# EAGLE schematic SOTB_LWC (EAGLE 9.6.2)
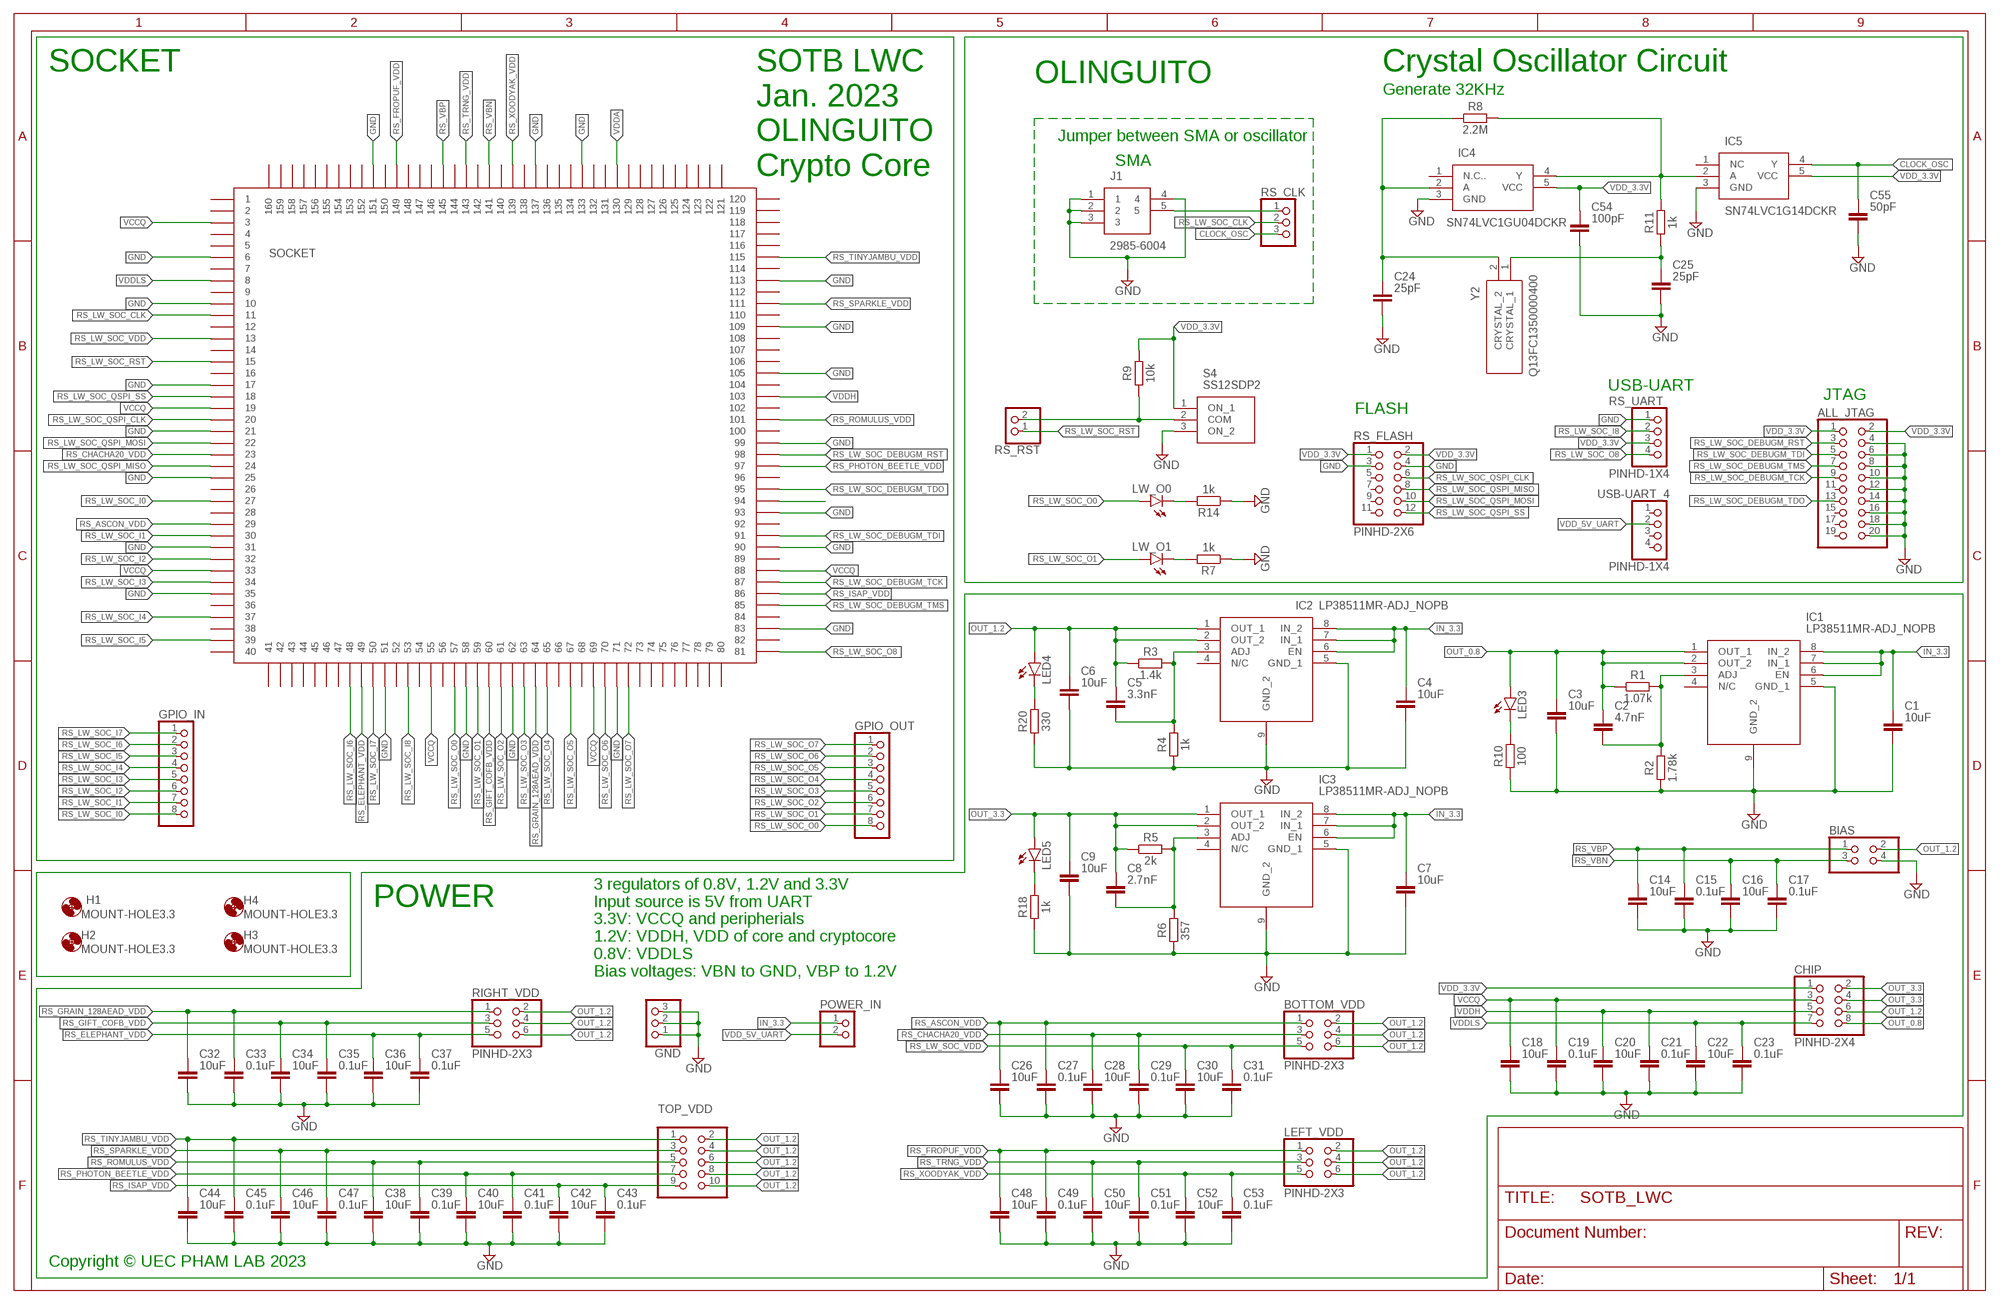
[diagram p0: schematic, sheet 1]

## Parts
ALL_JTAG  PINHD-2X10  [2X10]
BIAS  PINHD-2X2  [2X02]
BOTTOM_VDD  PINHD-2X3  [2X03]
C1  10uF  C_CHIP-1206(3216-METRIC)  [CAPC3216X135]
C2  4.7nF  C_CHIP-1206(3216-METRIC)  [CAPC3216X135]
C3  10uF  C_CHIP-1206(3216-METRIC)  [CAPC3216X135]
C4  10uF  C_CHIP-1206(3216-METRIC)  [CAPC3216X135]
C5  3.3nF  C_CHIP-1206(3216-METRIC)  [CAPC3216X135]
C6  10uF  C_CHIP-1206(3216-METRIC)  [CAPC3216X135]
C7  10uF  C_CHIP-1206(3216-METRIC)  [CAPC3216X135]
C8  2.7nF  C_CHIP-1206(3216-METRIC)  [CAPC3216X135]
C9  10uF  C_CHIP-1206(3216-METRIC)  [CAPC3216X135]
C14  10uF  C_CHIP-1206(3216-METRIC)  [CAPC3216X135]
C15  0.1uF  C_CHIP-1206(3216-METRIC)  [CAPC3216X135]
C16  10uF  C_CHIP-1206(3216-METRIC)  [CAPC3216X135]
C17  0.1uF  C_CHIP-1206(3216-METRIC)  [CAPC3216X135]
C18  10uF  C_CHIP-1206(3216-METRIC)  [CAPC3216X135]
C19  0.1uF  C_CHIP-1206(3216-METRIC)  [CAPC3216X135]
C20  10uF  C_CHIP-1206(3216-METRIC)  [CAPC3216X135]
C21  0.1uF  C_CHIP-1206(3216-METRIC)  [CAPC3216X135]
C22  10uF  C_CHIP-1206(3216-METRIC)  [CAPC3216X135]
C23  0.1uF  C_CHIP-1206(3216-METRIC)  [CAPC3216X135]
C24  25pF  C_CHIP-0805(2012-METRIC)  [CAPC2012X110]
C25  25pF  C_CHIP-0805(2012-METRIC)  [CAPC2012X110]
C26  10uF  C_CHIP-1206(3216-METRIC)  [CAPC3216X135]
C27  0.1uF  C_CHIP-1206(3216-METRIC)  [CAPC3216X135]
C28  10uF  C_CHIP-1206(3216-METRIC)  [CAPC3216X135]
C29  0.1uF  C_CHIP-1206(3216-METRIC)  [CAPC3216X135]
C30  10uF  C_CHIP-1206(3216-METRIC)  [CAPC3216X135]
C31  0.1uF  C_CHIP-1206(3216-METRIC)  [CAPC3216X135]
C32  10uF  C_CHIP-1206(3216-METRIC)  [CAPC3216X135]
C33  0.1uF  C_CHIP-1206(3216-METRIC)  [CAPC3216X135]
C34  10uF  C_CHIP-1206(3216-METRIC)  [CAPC3216X135]
C35  0.1uF  C_CHIP-1206(3216-METRIC)  [CAPC3216X135]
C36  10uF  C_CHIP-1206(3216-METRIC)  [CAPC3216X135]
C37  0.1uF  C_CHIP-1206(3216-METRIC)  [CAPC3216X135]
C38  10uF  C_CHIP-1206(3216-METRIC)  [CAPC3216X135]
C39  0.1uF  C_CHIP-1206(3216-METRIC)  [CAPC3216X135]
C40  10uF  C_CHIP-1206(3216-METRIC)  [CAPC3216X135]
C41  0.1uF  C_CHIP-1206(3216-METRIC)  [CAPC3216X135]
C42  10uF  C_CHIP-1206(3216-METRIC)  [CAPC3216X135]
C43  0.1uF  C_CHIP-1206(3216-METRIC)  [CAPC3216X135]
C44  10uF  C_CHIP-1206(3216-METRIC)  [CAPC3216X135]
C45  0.1uF  C_CHIP-1206(3216-METRIC)  [CAPC3216X135]
C46  10uF  C_CHIP-1206(3216-METRIC)  [CAPC3216X135]
C47  0.1uF  C_CHIP-1206(3216-METRIC)  [CAPC3216X135]
C48  10uF  C_CHIP-1206(3216-METRIC)  [CAPC3216X135]
C49  0.1uF  C_CHIP-1206(3216-METRIC)  [CAPC3216X135]
C50  10uF  C_CHIP-1206(3216-METRIC)  [CAPC3216X135]
C51  0.1uF  C_CHIP-1206(3216-METRIC)  [CAPC3216X135]
C52  10uF  C_CHIP-1206(3216-METRIC)  [CAPC3216X135]
C53  0.1uF  C_CHIP-1206(3216-METRIC)  [CAPC3216X135]
C54  100pF  C_CHIP-0805(2012-METRIC)  [CAPC2012X110]
C55  50pF  C_CHIP-0805(2012-METRIC)  [CAPC2012X110]
CHIP  PINHD-2X4  [2X04]
GND  PINHD-1X3  [1X03]
GPIO_IN  PINHD-1X8  [1X08]
GPIO_OUT  PINHD-1X8  [1X08]
H1  MOUNT-HOLE3.3  [3,3]
H2  MOUNT-HOLE3.3  [3,3]
H3  MOUNT-HOLE3.3  [3,3]
H4  MOUNT-HOLE3.3  [3,3]
IC1  LP38511MR-ADJ_NOPB  [SOIC127P600X170-9N]
IC2  LP38511MR-ADJ_NOPB  [SOIC127P600X170-9N]
IC3  LP38511MR-ADJ_NOPB  [SOIC127P600X170-9N]
IC4  SN74LVC1GU04DCKR  [SOT65P210X110-5N]
IC5  SN74LVC1G14DCKR  [SOT65P210X110-5N]
J1  2985-6004  [29856004]
LED3  LEDCHIPLED_0805  [CHIPLED_0805]
LED4  LEDCHIPLED_0805  [CHIPLED_0805]
LED5  LEDCHIPLED_0805  [CHIPLED_0805]
LEFT_VDD  PINHD-2X3  [2X03]
LW_O0  LEDCHIPLED_0805  [CHIPLED_0805]
LW_O1  LEDCHIPLED_0805  [CHIPLED_0805]
POWER_IN  PINHD-1X2  [1X02]
R1  1.07k  R_CHIP-1206(3216-METRIC)  [RESC3216X70]
R2  1.78k  R_CHIP-1206(3216-METRIC)  [RESC3216X70]
R3  1.4k  R_CHIP-1206(3216-METRIC)  [RESC3216X70]
R4  1k  R_CHIP-1206(3216-METRIC)  [RESC3216X70]
R5  2k  R_CHIP-1206(3216-METRIC)  [RESC3216X70]
R6  357  R_CHIP-1206(3216-METRIC)  [RESC3216X70]
R7  1k  R_CHIP-1206(3216-METRIC)  [RESC3216X70]
R8  2.2M  R_CHIP-1206(3216-METRIC)  [RESC3216X70]
R9  10k  R_CHIP-1206(3216-METRIC)  [RESC3216X70]
R10  100  R_CHIP-1206(3216-METRIC)  [RESC3216X70]
R11  1k  R_CHIP-1206(3216-METRIC)  [RESC3216X70]
R14  1k  R_CHIP-1206(3216-METRIC)  [RESC3216X70]
R18  1k  R_CHIP-1206(3216-METRIC)  [RESC3216X70]
R20  330  R_CHIP-1206(3216-METRIC)  [RESC3216X70]
RIGHT_VDD  PINHD-2X3  [2X03]
RS_CLK  PINHD-1X3  [1X03]
RS_FLASH  PINHD-2X6  [2X06]
RS_RST  PINHD-1X2  [1X02]
RS_UART  PINHD-1X4  [1X04]
S4  SS12SDP2  [SS12SDP2]
SOCKET  QFP28-160PIN  [QFP28-160PIN]
TOP_VDD  PINHD-2X5  [2X05]
USB-UART_4  PINHD-1X4  [1X04]
Y2  Q13FC1350000400  [Q13FC1350000400]

## Nets
CLOCK_OSC: C55.1 IC5.4(Y) RS_CLK.3
GND: ALL_JTAG.4 ALL_JTAG.6 ALL_JTAG.8 ALL_JTAG.10 ALL_JTAG.12 ALL_JTAG.14 ALL_JTAG.16 ALL_JTAG.18 ALL_JTAG.20 BIAS.4 C1.2 C3.2 C4.2 C6.2 C7.2 C9.2 C14.2 C15.2 C16.2 C17.2 C18.2 C19.2 C20.2 C21.2 C22.2 C23.2 C24.2 C25.2 C26.2 C27.2 C28.2 C29.2 C30.2 C31.2 C32.2 C33.2 C34.2 C35.2 C36.2 C37.2 C38.2 C39.2 C40.2 C41.2 C42.2 C43.2 C44.2 C45.2 C46.2 C47.2 C48.2 C49.2 C50.2 C51.2 C52.2 C53.2 C54.2 C55.2 GND.1 GND.2 GND.3 IC1.5(GND_1) IC1.9(GND_2) IC2.5(GND_1) IC2.9(GND_2) IC3.5(GND_1) IC3.9(GND_2) IC4.3(GND) IC5.3(GND) J1.1 J1.2 J1.3 J1.4 R2.1 R4.1 R6.1 R7.1 R10.1 R14.1 R18.1 R20.1 RS_FLASH.3 RS_FLASH.4 RS_UART.1 S4.3(ON_2) SOCKET.P$6 SOCKET.P$10 SOCKET.P$17 SOCKET.P$21 SOCKET.P$25 SOCKET.P$31 SOCKET.P$35 SOCKET.P$51 SOCKET.P$58 SOCKET.P$62 SOCKET.P$71 SOCKET.P$83 SOCKET.P$90 SOCKET.P$93 SOCKET.P$99 SOCKET.P$105 SOCKET.P$109 SOCKET.P$113 SOCKET.P$133 SOCKET.P$137 SOCKET.P$151
IN_3.3: C1.1 C4.1 C7.1 IC1.6(EN) IC1.7(IN_1) IC1.8(IN_2) IC2.6(EN) IC2.7(IN_1) IC2.8(IN_2) IC3.6(EN) IC3.7(IN_1) IC3.8(IN_2) POWER_IN.1
N$1: C2.2 IC1.3(ADJ) R1.2 R2.2
N$2: C5.2 IC2.3(ADJ) R3.2 R4.2
N$3: C8.2 IC3.3(ADJ) R5.2 R6.2
N$4: LW_O1.C R7.2
N$6: LW_O0.C R14.2
N$7: C24.1 IC4.2(A) R8.1 Y2.2(CRYSTAL_2)
N$8: IC4.4(Y) IC5.2(A) R8.2 R11.2
N$9: LED3.C R10.2
N$10: LED4.C R20.2
N$11: LED5.C R18.2
N$13: C25.1 R11.1 Y2.1(CRYSTAL_1)
N$94: SOCKET.P$94
OUT_0.8: C2.1 C3.1 CHIP.8 IC1.1(OUT_1) IC1.2(OUT_2) LED3.A R1.1
OUT_1.2: BIAS.2 BOTTOM_VDD.2 BOTTOM_VDD.4 BOTTOM_VDD.6 C5.1 C6.1 CHIP.6 IC2.1(OUT_1) IC2.2(OUT_2) LED4.A LEFT_VDD.2 LEFT_VDD.4 LEFT_VDD.6 R3.1 RIGHT_VDD.2 RIGHT_VDD.4 RIGHT_VDD.6 TOP_VDD.2 TOP_VDD.4 TOP_VDD.6 TOP_VDD.8 TOP_VDD.10
OUT_3.3: C8.1 C9.1 CHIP.2 CHIP.4 IC3.1(OUT_1) IC3.2(OUT_2) LED5.A R5.1
RS_ASCON_VDD: BOTTOM_VDD.1 C26.1 C27.1 SOCKET.P$29
RS_CHACHA20_VDD: BOTTOM_VDD.3 C28.1 C29.1 SOCKET.P$23
RS_ELEPHANT_VDD: C36.1 C37.1 RIGHT_VDD.5 SOCKET.P$49
RS_FROPUF_VDD: C48.1 C49.1 LEFT_VDD.1 SOCKET.P$149
RS_GIFT_COFB_VDD: C34.1 C35.1 RIGHT_VDD.3 SOCKET.P$60
RS_GRAIN_128AEAD_VDD: C32.1 C33.1 RIGHT_VDD.1 SOCKET.P$64
RS_ISAP_VDD: C42.1 C43.1 SOCKET.P$86 TOP_VDD.9
RS_LW_SOC_CLK: RS_CLK.2 SOCKET.P$11
RS_LW_SOC_DEBUGM_RST: ALL_JTAG.3 SOCKET.P$98
RS_LW_SOC_DEBUGM_TCK: ALL_JTAG.9 SOCKET.P$87
RS_LW_SOC_DEBUGM_TDI: ALL_JTAG.5 SOCKET.P$91
RS_LW_SOC_DEBUGM_TDO: ALL_JTAG.13 SOCKET.P$95
RS_LW_SOC_DEBUGM_TMS: ALL_JTAG.7 SOCKET.P$85
RS_LW_SOC_I0: GPIO_IN.8 SOCKET.P$27
RS_LW_SOC_I1: GPIO_IN.7 SOCKET.P$30
RS_LW_SOC_I2: GPIO_IN.6 SOCKET.P$32
RS_LW_SOC_I3: GPIO_IN.5 SOCKET.P$34
RS_LW_SOC_I4: GPIO_IN.4 SOCKET.P$37
RS_LW_SOC_I5: GPIO_IN.3 SOCKET.P$39
RS_LW_SOC_I6: GPIO_IN.2 SOCKET.P$48
RS_LW_SOC_I7: GPIO_IN.1 SOCKET.P$50
RS_LW_SOC_I8: RS_UART.2 SOCKET.P$53
RS_LW_SOC_O0: GPIO_OUT.8 LW_O0.A SOCKET.P$57
RS_LW_SOC_O1: GPIO_OUT.7 LW_O1.A SOCKET.P$59
RS_LW_SOC_O2: GPIO_OUT.6 SOCKET.P$61
RS_LW_SOC_O3: GPIO_OUT.5 SOCKET.P$63
RS_LW_SOC_O4: GPIO_OUT.4 SOCKET.P$65
RS_LW_SOC_O5: GPIO_OUT.3 SOCKET.P$67
RS_LW_SOC_O6: GPIO_OUT.2 SOCKET.P$70
RS_LW_SOC_O7: GPIO_OUT.1 SOCKET.P$72
RS_LW_SOC_O8: RS_UART.4 SOCKET.P$81
RS_LW_SOC_QSPI_CLK: RS_FLASH.6 SOCKET.P$20
RS_LW_SOC_QSPI_MISO: RS_FLASH.8 SOCKET.P$24
RS_LW_SOC_QSPI_MOSI: RS_FLASH.10 SOCKET.P$22
RS_LW_SOC_QSPI_SS: RS_FLASH.12 SOCKET.P$18
RS_LW_SOC_RST: RS_RST.1 SOCKET.P$15
RS_LW_SOC_VDD: BOTTOM_VDD.5 C30.1 C31.1 SOCKET.P$13
RS_PHOTON_BEETLE_VDD: C40.1 C41.1 SOCKET.P$97 TOP_VDD.7
RS_ROMULUS_VDD: C38.1 C39.1 SOCKET.P$101 TOP_VDD.5
RS_SPARKLE_VDD: C46.1 C47.1 SOCKET.P$111 TOP_VDD.3
RS_TINYJAMBU_VDD: C44.1 C45.1 SOCKET.P$115 TOP_VDD.1
RS_TRNG_VDD: C50.1 C51.1 LEFT_VDD.3 SOCKET.P$143
RS_VBN: BIAS.3 C16.1 C17.1 SOCKET.P$141
RS_VBP: BIAS.1 C14.1 C15.1 SOCKET.P$145
RS_XOODYAK_VDD: C52.1 C53.1 LEFT_VDD.5 SOCKET.P$139
RST_SW3: R9.1 RS_RST.2 S4.2(COM)
SMA_CLK1: J1.5 RS_CLK.1
VCCQ: C18.1 C19.1 CHIP.3 SOCKET.P$3 SOCKET.P$19 SOCKET.P$33 SOCKET.P$55 SOCKET.P$69 SOCKET.P$88
VDD_3.3V: ALL_JTAG.1 ALL_JTAG.2 C54.1 CHIP.1 IC4.5(VCC) IC5.5(VCC) R9.2 RS_FLASH.1 RS_FLASH.2 RS_UART.3 S4.1(ON_1)
VDD_5V_UART: POWER_IN.2 USB-UART_4.2
VDDA: SOCKET.P$130
VDDH: C20.1 C21.1 CHIP.5 SOCKET.P$103
VDDLS: C22.1 C23.1 CHIP.7 SOCKET.P$8
Unconnected: ALL_JTAG.11 ALL_JTAG.15 ALL_JTAG.17 ALL_JTAG.19 IC1.4(N/C) IC2.4(N/C) IC3.4(N/C) IC4.1(N.C..) IC5.1(NC) RS_FLASH.5 RS_FLASH.7 RS_FLASH.9 RS_FLASH.11 SOCKET.P$1 SOCKET.P$2 SOCKET.P$4 SOCKET.P$5 SOCKET.P$7 SOCKET.P$9 SOCKET.P$12 SOCKET.P$14 SOCKET.P$16 SOCKET.P$26 SOCKET.P$28 SOCKET.P$36 SOCKET.P$38 SOCKET.P$40 SOCKET.P$41 SOCKET.P$42 SOCKET.P$43 SOCKET.P$44 SOCKET.P$45 SOCKET.P$46 SOCKET.P$47 SOCKET.P$52 SOCKET.P$54 SOCKET.P$56 SOCKET.P$66 SOCKET.P$68 SOCKET.P$73 SOCKET.P$74 SOCKET.P$75 SOCKET.P$76 SOCKET.P$77 SOCKET.P$78 SOCKET.P$79 SOCKET.P$80 SOCKET.P$82 SOCKET.P$84 SOCKET.P$89 SOCKET.P$92 SOCKET.P$96 SOCKET.P$100 SOCKET.P$102 SOCKET.P$104 SOCKET.P$106 SOCKET.P$107 SOCKET.P$108 SOCKET.P$110 SOCKET.P$112 SOCKET.P$114 SOCKET.P$116 SOCKET.P$117 SOCKET.P$118 SOCKET.P$119 SOCKET.P$120 SOCKET.P$121 SOCKET.P$122 SOCKET.P$123 SOCKET.P$124 SOCKET.P$125 SOCKET.P$126 SOCKET.P$127 SOCKET.P$128 SOCKET.P$129 SOCKET.P$131 SOCKET.P$132 SOCKET.P$134 SOCKET.P$135 SOCKET.P$136 SOCKET.P$138 SOCKET.P$140 SOCKET.P$142 SOCKET.P$144 SOCKET.P$146 SOCKET.P$147 SOCKET.P$148 SOCKET.P$150 SOCKET.P$152 SOCKET.P$153 SOCKET.P$154 SOCKET.P$155 SOCKET.P$156 SOCKET.P$157 SOCKET.P$158 SOCKET.P$159 SOCKET.P$160 USB-UART_4.1 USB-UART_4.3 USB-UART_4.4

## Notes on the sheet
- SOCKET | Crystal Oscillator Circuit
- OLINGUITO
- Generate 32KHz
- Jumper between SMA or oscillator
- SMA
- SOTB LWC
  Jan. 2023
  OLINGUITO
  Crypto Core
- USB-UART
- JTAG
- FLASH
- POWER
- 3 regulators of 0.8V, 1.2V and 3.3V
  Input source is 5V from UART
  3.3V: VCCQ and peripherials
  1.2V: VDDH, VDD of core and cryptocore
  0.8V: VDDLS
  Bias voltages: VBN to GND, VBP to 1.2V
- Copyright © UEC PHAM LAB 2023

## Library data of the parts
ALL_JTAG = pinhead:PINHD-2X10: PIN HEADER
BIAS = pinhead:PINHD-2X2: PIN HEADER
BOTTOM_VDD LEFT_VDD RIGHT_VDD = Connector:PINHD-2X3: PIN HEADER; CATEGORY: CONNECTOR; SUB-CATEGORY: PIN-HEADER
C1-C9 C14-C55 = Capacitor:C: Capacitor - Generic; CATEGORY: Capacitor
CHIP = Connector:PINHD-2X4: PIN HEADER; CATEGORY: CONNECTOR; SUB-CATEGORY: PIN-HEADER
GND RS_CLK = pinhead:PINHD-1X3: PIN HEADER
GPIO_IN GPIO_OUT = pinhead:PINHD-1X8: PIN HEADER
H1-H4 = holes:MOUNT-HOLE: MOUNTING HOLE with drill center marker
IC1-IC3 = SamacSys_Parts:LP38511MR-ADJ_NOPB: Texas Instruments LP38511MR-ADJ/NOPB, LDO Voltage Regulator, Adjustable 0.8A, 0.5 3.3 V +/-2%, 8-Pin PSOP Source: Datasheet <http://www.ti.com/lit/gpn/lp38511-adj>; ARROW_PART_NUMBER: LP38511MR-ADJ/NOPB; ARROW_PRICE-STOCK: https://www.arrow.com/en/products/lp38511mr-adjnopb/texas-instruments; DESCRIPTION: Texas Instruments LP38511MR-ADJ/NOPB, LDO Voltage Regulator, Adjustable 0.8A, 0.5 3.3 V +/-2%, 8-Pin PSOP; HEIGHT: 1.7mm; MANUFACTURER_NAME: Texas Instruments; MANUFACTURER_PART_NUMBER: LP38511MR-ADJ/NOPB; MOUSER_PART_NUMBER: 926-38511MR-ADJ/NOPB; MOUSER_PRICE-STOCK: https://www.mouser.co.uk/ProductDetail/Texas-Instruments/LP38511MR-ADJ-NOPB?qs=1FNqv8aZn1Rpii1QpyVwqA%3D%3D
IC4 = SamacSys_Parts:SN74LVC1GU04DCKR: Single Inverter Gate Source: Datasheet <http://www.ti.com/lit/gpn/sn74lvc1gu04>; ARROW_PART_NUMBER: SN74LVC1GU04DCKR; ARROW_PRICE-STOCK: https://www.arrow.com/en/products/sn74lvc1gu04dckr/texas-instruments?region=nac; DESCRIPTION: Single Inverter Gate; HEIGHT: 1.1mm; MANUFACTURER_NAME: Texas Instruments; MANUFACTURER_PART_NUMBER: SN74LVC1GU04DCKR; MOUSER_PART_NUMBER: 595-SN74LVC1GU04DCKR; MOUSER_PRICE-STOCK: https://www.mouser.co.uk/ProductDetail/Texas-Instruments/SN74LVC1GU04DCKR?qs=HE9hdJajmeplLYeGBFwXAQ%3D%3D
IC5 = SamacSys_Parts:SN74LVC1G14DCKR: SN74LVC1G14 Single Schmitt-Trigger Inverter Source: Datasheet <http://www.ti.com/lit/ds/symlink/sn74lvc1g14.pdf>; ARROW_PART_NUMBER: SN74LVC1G14DCKR; ARROW_PRICE-STOCK: https://www.arrow.com/en/products/sn74lvc1g14dckr/texas-instruments?region=nac; DESCRIPTION: SN74LVC1G14 Single Schmitt-Trigger Inverter; HEIGHT: 1.1mm; MANUFACTURER_NAME: Texas Instruments; MANUFACTURER_PART_NUMBER: SN74LVC1G14DCKR; MOUSER_PART_NUMBER: 595-SN74LVC1G14DCKR; MOUSER_PRICE-STOCK: https://www.mouser.co.uk/ProductDetail/Texas-Instruments/SN74LVC1G14DCKR?qs=j%2FZo4ajzVJKuhrRdLjfZIw%3D%3D
J1 = SamacSys_Parts:2985-6004: RF Connectors / Coaxial Connectors SMA F PCB Thru-Hole Conn, 50-OHMS 1000 Source: Datasheet <https://componentsearchengine.com//2985-6004.pdf>; DESCRIPTION: RF Connectors / Coaxial Connectors SMA F PCB Thru-Hole Conn, 50-OHMS 1000; HEIGHT: 9.54mm; MANUFACTURER_NAME: Amphenol; MANUFACTURER_PART_NUMBER: 2985-6004; MOUSER_PART_NUMBER: 523-2985-6004; MOUSER_PRICE-STOCK: https://www.mouser.co.uk/ProductDetail/Amphenol-SV-Microwave/2985-6004?qs=jyo2EwfRkUNkt8LGijRXFQ%3D%3D
LED3-LED5 LW_O0 LW_O1 = led:LED: LED OSRAM: - CHIPLED LG R971, LG N971, LY N971, LG Q971, LY Q971, LO R971, LY R971 LH N974, LH R974 LS Q976, LO Q976, LY Q976 LO Q996 - Hyper CHIPLED LW Q18S LB Q993, LB Q99A, LB R99A - SideLED LS A670, LO A670, LY A670, LG A670, LP A670 LB A673, LV A673, LT A673, LW A673 LH A674 LY A675 LS A676, LA A676, LO A676, LY A676, LW A676 LS A679, LY A679, LG A679 - Hyper Micro SIDELED® LS Y876, LA Y876, LO Y876, LY Y876 LT Y87S - SmartLED LW L88C, LW L88S LB L89C, LB L89S, LG L890 LS L89K, LO L89K, LY L89K LS L896, LA L896, LO L896, LY L896 - TOPLED LS T670, LO T670, LY T670, LG T670, LP T670 LSG T670, LSP T670, LSY T670, LOP T670, LYG T670 LG T671, LOG T671, LSG T671 LB T673, LV T673, LT T673, LW T673 LH T674 LS T676, LA T676, LO T676, LY T676, LB T676, LH T676, LSB T676, LW T676 LB T67C, LV T67C, LT T67C, LS T67K, LO T67K, LY T67K, LW E67C LS E67B, LA E67B, LO E67B, LY E67B, LB E67C, LV E67C, LT E67C LW T67C LS T679, LY T679, LG T679 LS T770, LO T770, LY T770, LG T770, LP T770 LB T773, LV T773, LT T773, LW T773 LH T774 LS E675, LA E675, LY E675, LS T675 LS T776, LA T776, LO T776, LY T776, LB T776 LHGB T686 LT T68C, LB T68C - Hyper Mini TOPLED® LB M676 - Mini TOPLED Santana® LG M470 LS M47K, LO M47K, LY M47K Source: http://www.osram.convergy.de LUXEON: - LUMILED® LXK2-PW12-R00, LXK2-PW12-S00, LXK2-PW14-U00, LXK2-PW14-V00 LXK2-PM12-R00, LXK2-PM12-S00, LXK2-PM14-U00 LXK2-PE12-Q00, LXK2-PE12-R00, LXK2-PE12-S00, LXK2-PE14-T00, LXK2-PE14-U00 LXK2-PB12-K00, LXK2-PB12-L00, LXK2-PB12-M00, LXK2-PB14-N00, LXK2-PB14-P00, LXK2-PB14-Q00 LXK2-PR12-L00, LXK2-PR12-M00, LXK2-PR14-Q00, LXK2-PR14-R00 LXK2-PD12-Q00, LXK2-PD12-R00, LXK2-PD12-S00 LXK2-PH12-R00, LXK2-PH12-S00 LXK2-PL12-P00, LXK2-PL12-Q00, LXK2-PL12-R00 Source: www.luxeon.com KINGBRIGHT: KA-3528ASYC Source: www.kingbright.com
POWER_IN RS_RST = pinhead:PINHD-1X2: PIN HEADER
R1-R11 R14 R18 R20 = Resistor:R: Resistor Fixed - Generic; CATEGORY: Resistor; SUB-CATEGORY: Fixed
RS_FLASH = Connector:PINHD-2X6: PIN HEADER; CATEGORY: CONNECTOR; SUB-CATEGORY: PIN-HEADER
RS_UART USB-UART_4 = Connector:PINHD-1X4: PIN HEADER; CATEGORY: CONNECTOR; SUB-CATEGORY: PIN-HEADER
S4 = SamacSys_Parts:SS12SDP2: Switch, Slide,Sub Miniature,Top Actuated,SPDT, On-none-On Source: Datasheet; DESCRIPTION: Switch, Slide,Sub Miniature,Top Actuated,SPDT, On-none-On; HEIGHT: 4mm; MANUFACTURER_NAME: NKK Switches; MANUFACTURER_PART_NUMBER: SS12SDP2; MOUSER_PART_NUMBER: 633-SS12SDP2; MOUSER_PRICE-STOCK: https://www.mouser.co.uk/ProductDetail/NKK-Switches/SS12SDP2?qs=Av7JdS0MGqKsG%252BWOKKtU2w%3D%3D
SOCKET = QFP28-160PIN_SAPPORO_ROBOTICS:QFP28-160PIN
TOP_VDD = pinhead:PINHD-2X5: PIN HEADER
Y2 = SamacSys_Parts:Q13FC1350000400: SMD Crystal Resonators 32.768KHz +/-20ppm SMD-3215_2P RoHS Source: Datasheet <https://datasheet.lcsc.com/szlcsc/1901081604_Seiko-Epson-Q13FC1350000400_C32346.pdf>; DESCRIPTION: SMD Crystal Resonators 32.768KHz +/-20ppm SMD-3215_2P RoHS; HEIGHT: 0.9mm; MANUFACTURER_NAME: SEIKO EPSON; MANUFACTURER_PART_NUMBER: Q13FC1350000400